# EAGLE design dado_dig (EAGLE 9.3.0)
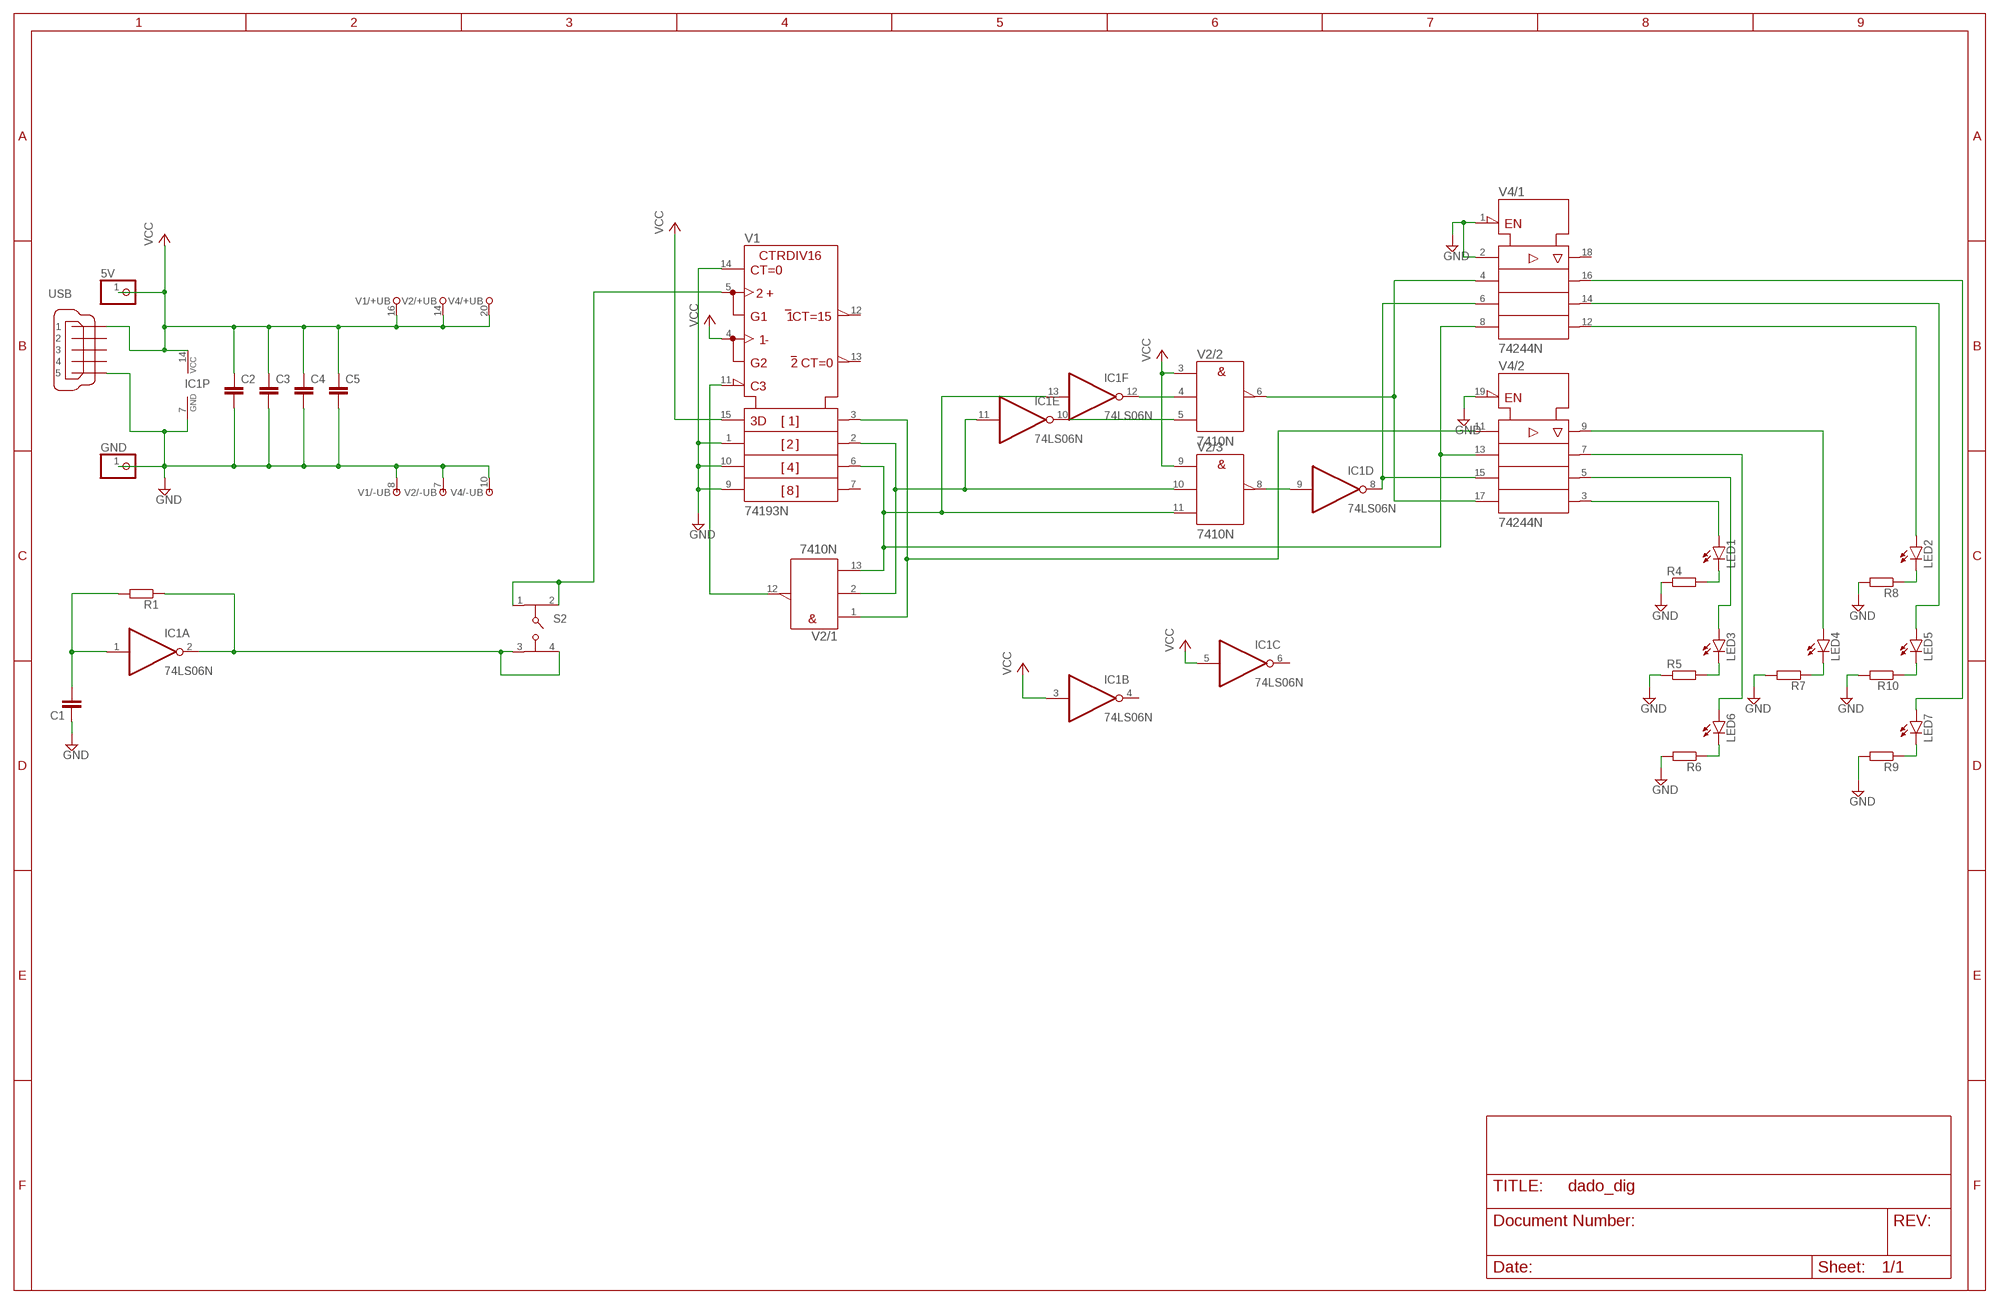
[diagram p0: schematic, sheet 1]

## Parts
5V  PINHD-1X1  [1X01]
C1  C-EUC0805K  [C0805K]
C2  C-EUC0805K  [C0805K]
C3  C-EUC0805K  [C0805K]
C4  C-EUC0805K  [C0805K]
C5  C-EUC0805K  [C0805K]
GND  PINHD-1X1  [1X01]
IC1  74LS06N  [DIL14]
LED1  LED5MM  [LED5MM]
LED2  LED5MM  [LED5MM]
LED3  LED5MM  [LED5MM]
LED4  LED5MM  [LED5MM]
LED5  LED5MM  [LED5MM]
LED6  LED5MM  [LED5MM]
LED7  LED5MM  [LED5MM]
R1  R-EU_M0805  [M0805]
R4  R-EU_M0805  [M0805]
R5  R-EU_M0805  [M0805]
R6  R-EU_M0805  [M0805]
R7  R-EU_M0805  [M0805]
R8  R-EU_M0805  [M0805]
R9  R-EU_M0805  [M0805]
R10  R-EU_M0805  [M0805]
S2  430456073736  [430456073736]
USB  MINI-USB-32005-301  [32005-301]
V1  74193N  [DIL16]
V2  7410N  [DIL14]
V4  74244N  [DIL20]

## Nets
GND: C1.1 C2.2 C3.2 C4.2 C5.2 GND.1 IC1.7(P:GND) R4.1 R5.1 R6.2 R7.2 R8.2 R9.2 R10.2 USB.5 V1.1(B) V1.8(-UB) V1.9(D) V1.10(C) V1.14(CLR) V2.7(/-UB:-UB) V4.1(/1:!G) V4.2(/1:A1) V4.10(/-UB:-UB) V4.19(/2:!G)
N$1: IC1.13(F:I) V1.6(QC) V2.11(/3:C) V2.13(/1:C) V4.8(/1:A4) V4.13(/2:A2)
N$2: IC1.9(D:I) V2.8(/3:Y)
N$3: C1.2 IC1.1(A:I) R1.2
N$4: IC1.12(F:O) V2.4(/2:B)
N$5: IC1.2(A:O) R1.1 S2.3 S2.4
N$6: V1.3(QA) V2.1(/1:A) V4.11(/2:A1)
N$7: IC1.10(E:O) V2.5(/2:C)
N$8: S2.1 S2.2 V1.5(UP)
N$10: IC1.11(E:I) V1.2(QB) V2.2(/1:B) V2.10(/3:B)
N$11: LED6.K(C) R6.1
N$12: LED4.A V4.9(/2:Y1)
N$13: LED5.K(C) R10.1
N$14: LED3.K(C) R5.2
N$15: LED5.A V4.14(/1:Y3)
N$16: LED1.A V4.3(/2:Y4)
N$17: LED4.K(C) R7.1
N$18: LED2.A V4.12(/1:Y4)
N$19: LED2.K(C) R8.1
N$20: LED7.K(C) R9.1
N$21: LED1.K(C) R4.2
N$22: LED7.A V4.16(/1:Y2)
N$24: V1.11(!LOAD) V2.12(/1:Y)
N$25: LED6.A V4.7(/2:Y2)
N$26: V2.6(/2:Y) V4.4(/1:A2) V4.17(/2:A4)
N$27: LED3.A V4.5(/2:Y3)
N$30: IC1.8(D:O) V4.6(/1:A3) V4.15(/2:A3)
VCC: 5V.1 C2.1 C3.1 C4.1 C5.1 IC1.3(B:I) IC1.5(C:I) IC1.14(P:VCC) USB.1 V1.4(DOWN) V1.15(A) V1.16(+UB) V2.3(/2:A) V2.9(/3:A) V2.14(/+UB:+UB) V4.20(/+UB:+UB)
Unconnected: IC1.4(B:O) IC1.6(C:O) USB.2 USB.3 USB.4 V1.7(QD) V1.12(!CO) V1.13(!BO) V4.18(/1:Y1)

## Library data of the parts
5V GND = pinhead:PINHD-1X1: PIN HEADER
C1-C5 = rcl:C-EU: CAPACITOR, European symbol; SPICEPREFIX: C
IC1 = 74xx-eu:74*06: Hex INVERTER, open collector high-voltage output
LED1-LED7 = led:LED: LED OSRAM: - CHIPLED LG R971, LG N971, LY N971, LG Q971, LY Q971, LO R971, LY R971 LH N974, LH R974 LS Q976, LO Q976, LY Q976 LO Q996 - Hyper CHIPLED LW Q18S LB Q993, LB Q99A, LB R99A - SideLED LS A670, LO A670, LY A670, LG A670, LP A670 LB A673, LV A673, LT A673, LW A673 LH A674 LY A675 LS A676, LA A676, LO A676, LY A676, LW A676 LS A679, LY A679, LG A679 - Hyper Micro SIDELED® LS Y876, LA Y876, LO Y876, LY Y876 LT Y87S - SmartLED LW L88C, LW L88S LB L89C, LB L89S, LG L890 LS L89K, LO L89K, LY L89K LS L896, LA L896, LO L896, LY L896 - TOPLED LS T670, LO T670, LY T670, LG T670, LP T670 LSG T670, LSP T670, LSY T670, LOP T670, LYG T670 LG T671, LOG T671, LSG T671 LB T673, LV T673, LT T673, LW T673 LH T674 LS T676, LA T676, LO T676, LY T676, LB T676, LH T676, LSB T676, LW T676 LB T67C, LV T67C, LT T67C, LS T67K, LO T67K, LY T67K, LW E67C LS E67B, LA E67B, LO E67B, LY E67B, LB E67C, LV E67C, LT E67C LW T67C LS T679, LY T679, LG T679 LS T770, LO T770, LY T770, LG T770, LP T770 LB T773, LV T773, LT T773, LW T773 LH T774 LS E675, LA E675, LY E675, LS T675 LS T776, LA T776, LO T776, LY T776, LB T776 LHGB T686 LT T68C, LB T68C - Hyper Mini TOPLED® LB M676 - Mini TOPLED Santana® LG M470 LS M47K, LO M47K, LY M47K Source: http://www.osram.convergy.de LUXEON: - LUMILED® LXK2-PW12-R00, LXK2-PW12-S00, LXK2-PW14-U00, LXK2-PW14-V00 LXK2-PM12-R00, LXK2-PM12-S00, LXK2-PM14-U00 LXK2-PE12-Q00, LXK2-PE12-R00, LXK2-PE12-S00, LXK2-PE14-T00, LXK2-PE14-U00 LXK2-PB12-K00, LXK2-PB12-L00, LXK2-PB12-M00, LXK2-PB14-N00, LXK2-PB14-P00, LXK2-PB14-Q00 LXK2-PR12-L00, LXK2-PR12-M00, LXK2-PR14-Q00, LXK2-PR14-R00 LXK2-PD12-Q00, LXK2-PD12-R00, LXK2-PD12-S00 LXK2-PH12-R00, LXK2-PH12-S00 LXK2-PL12-P00, LXK2-PL12-Q00, LXK2-PL12-R00 Source: www.luxeon.com KINGBRIGHT: KA-3528ASYC Source: www.kingbright.com
R1 R4-R10 = resistor:R-EU_: RESISTOR, European symbol
S2 = tactil:430456073736: 12x12 mm THT washable WS-TATV <http://katalog.we-online.de/media/images/v2/Family_WS_TSW_THT_4304x60xx7x6_pf2.jpg> Details see: http://katalog.we-online.de/em/datasheet/4304x60737x6.pdf 2015 (C) Wurth Elektronik; AVAILABILITY: Unavailable; DESCRIPTION: SWITCH TACTILE SPST-NO 0.05A 12V; MF: Wurth Electronics; MP: 430456073736; PACKAGE: None; PRICE: None
USB = con-cypressindustries:MINI-USB-: MINI USB-B Conector Source: www.cypressindustries.com; OC_FARNELL: unknown; OC_NEWARK: unknown
V1 = 74ttl-din:74*193: Synchronus 4-bit up down COUNTER
V2 = 74ttl-din:74*10: Triple 3-input NAND gate
V4 = 74ttl-din:74*244: Octal BUFFER and LINE DRIVER, 3-state

## Board
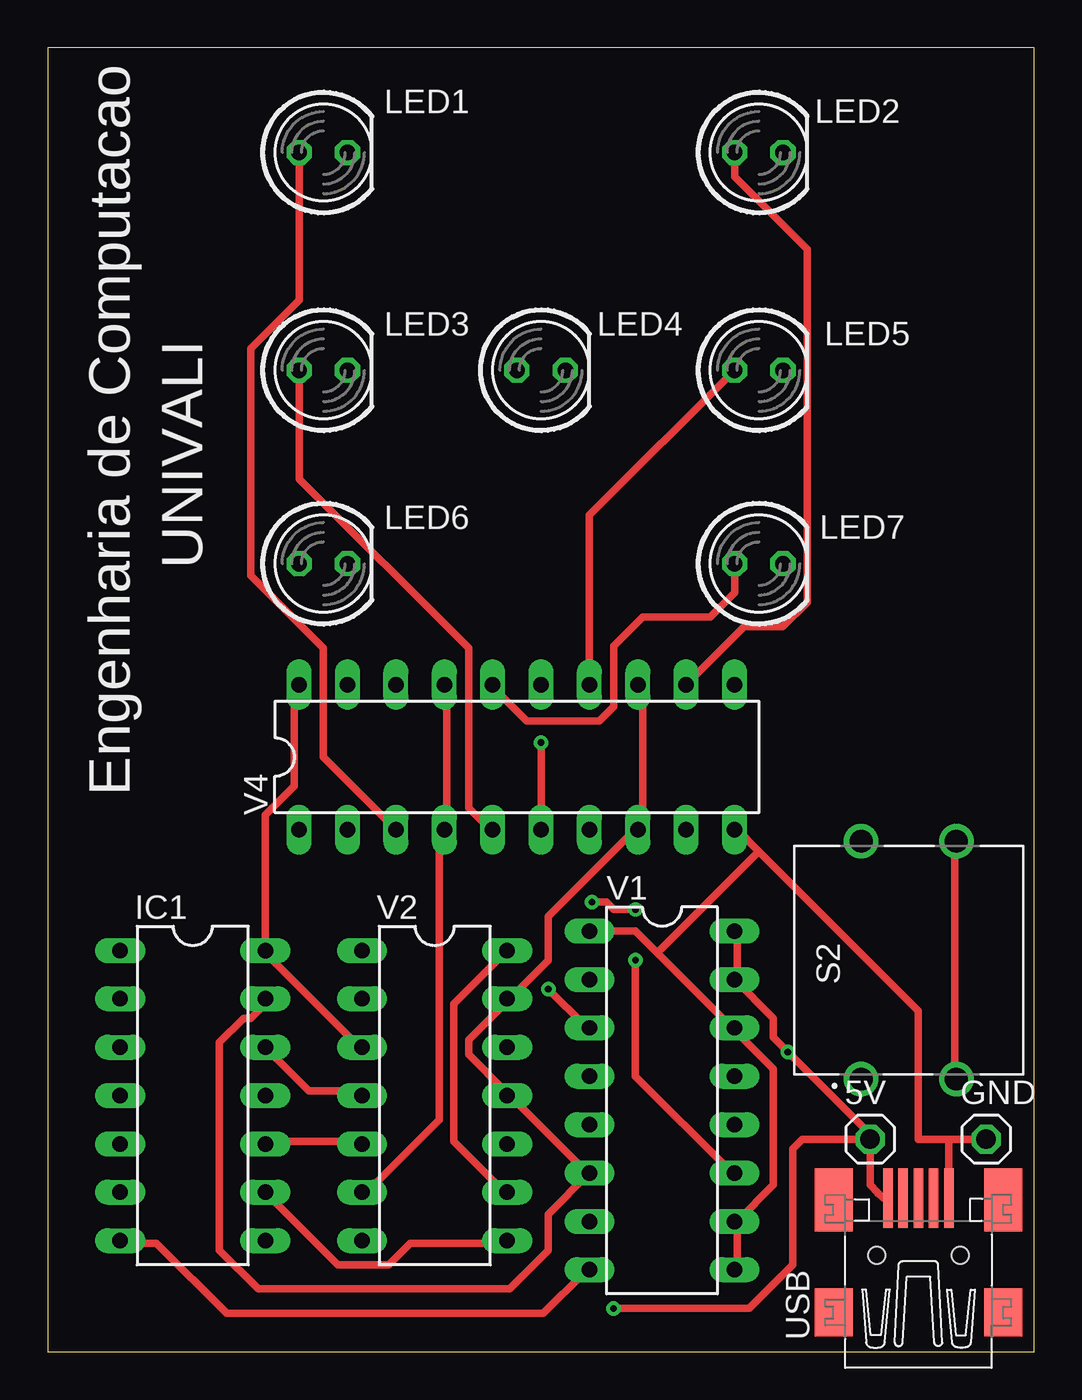
[diagram p1: board, top side]
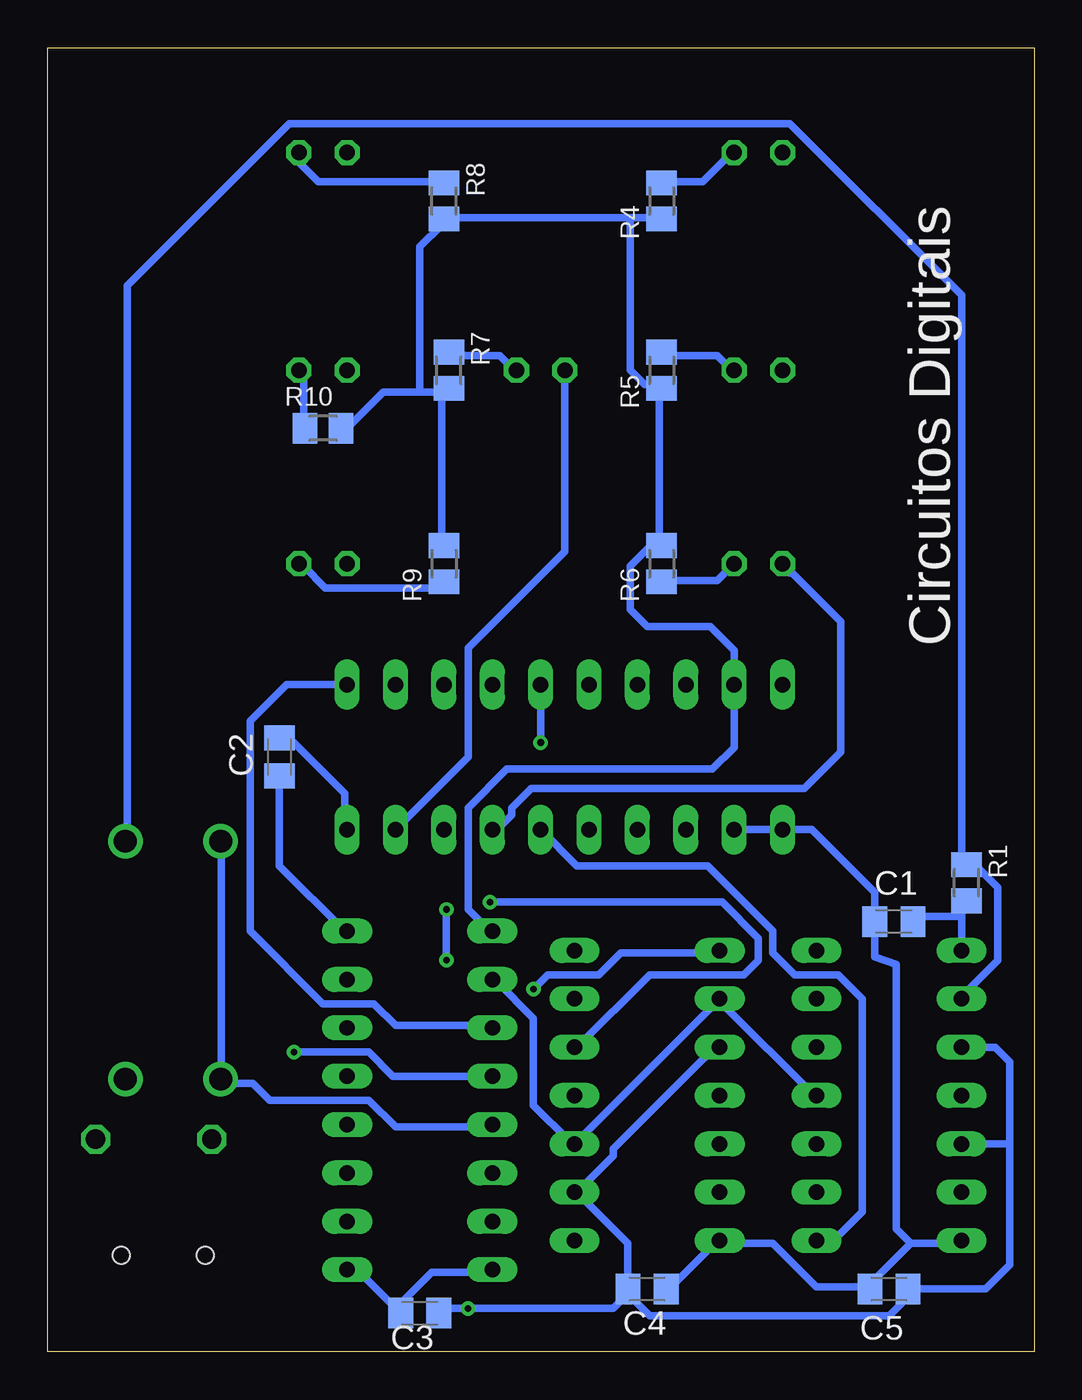
[diagram p2: board, bottom side, seen from below]

Size 51.8 x 68.5 mm. Coordinates in mm from the lower left corner, seen from the top.
Outline: 0,0 51.8,0 51.8,68.5 0,68.5 0,0
Copper layers (1*16): Top 0.035mm / dielectric 1.5mm / Bottom 0.035mm
Design rules "default *": minimum track width 15mil, minimum drill 0.35mm, track to track 15mil, track to pad 15mil, pad to pad 15mil, via to via 15mil, smd to smd 6mil, copper to edge 40mil, drill to drill 12mil, minimum pad ring 10mil, minimum via ring 8mil, stop-mask expansion 4mil, vias tented up to drill 0mil, thermal gap 10mil

### Footprints (pad centres in the part's own frame; a part is rotated, then mirrored left to right if it is on the bottom)
1X01 = drill 1.016 octagon: 1 0,0
C0805K = smd 1.3 x 1.6: 1 -1,0; 2 1,0
DIL14 = drill 0.813 long: 1 -7.62,-3.81; 2 -5.08,-3.81; 3 -2.54,-3.81; 4 0,-3.81; 5 2.54,-3.81; 6 5.08,-3.81; 7 7.62,-3.81; 8 7.62,3.81; 9 5.08,3.81; 10 2.54,3.81; 11 0,3.81; 12 -2.54,3.81; 13 -5.08,3.81; 14 -7.62,3.81
LED5MM = drill 0.813 octagon: A -1.27,0; K 1.27,0
M0805 = smd 1.3 x 1.6: 1 -0.95,0; 2 0.95,0
430456073736 = drill 1.2: 1 -6.25,2.5; 2 6.25,2.5; 3 -6.25,-2.5; 4 6.25,-2.5
32005-301 = smd 3.1 x 0.5: 1 3,1.6; 2 3,0.8; 3 3,0; 4 3,-0.8; 5 3,-1.6 | smd 2.5 x 2: M1 -3,-4.45; M2 -3,4.45 | smd 3.3 x 2: M3 2.9,4.45; M4 2.9,-4.45 | hole 0.9: 0,2.2; 0,-2.2
DIL16 = drill 0.813 long: 1 -8.89,-3.81; 2 -6.35,-3.81; 3 -3.81,-3.81; 4 -1.27,-3.81; 5 1.27,-3.81; 6 3.81,-3.81; 7 6.35,-3.81; 8 8.89,-3.81; 9 8.89,3.81; 10 6.35,3.81; 11 3.81,3.81; 12 1.27,3.81; 13 -1.27,3.81; 14 -3.81,3.81; 15 -6.35,3.81; 16 -8.89,3.81
DIL20 = drill 0.813 long: 1 -11.43,-3.81; 2 -8.89,-3.81; 3 -6.35,-3.81; 4 -3.81,-3.81; 5 -1.27,-3.81; 6 1.27,-3.81; 7 3.81,-3.81; 8 6.35,-3.81; 9 8.89,-3.81; 10 11.43,-3.81; 11 11.43,3.81; 12 8.89,3.81; 13 6.35,3.81; 14 3.81,3.81; 15 1.27,3.81; 16 -1.27,3.81; 17 -3.81,3.81; 18 -6.35,3.81; 19 -8.89,3.81; 20 -11.43,3.81

### Placement (x,y rotation side)
5V  43.18,11.18 0 top
C1  7.37,22.61 0 bottom
C2  39.62,31.24 90 bottom
C3  32.26,2.03 180 bottom
C4  20.32,3.3 0 bottom
C5  7.62,3.3 180 bottom
GND  49.28,11.18 0 top
IC1  7.62,13.46 270 top
LED1  14.48,62.99 0 top
LED2  37.34,62.99 0 top
LED3  14.48,51.56 0 top
LED4  25.91,51.56 0 top
LED5  37.34,51.56 0 top
LED6  14.48,41.4 0 top
LED7  37.34,41.4 0 top
R1  3.56,24.64 270 bottom
R4  19.56,60.45 90 bottom
R5  19.56,51.56 90 bottom
R6  19.56,41.4 90 bottom
R7  30.73,51.56 270 bottom
R8  30.99,60.45 270 bottom
R9  30.99,41.4 90 bottom
R10  37.34,48.51 0 bottom
S2  45.21,20.57 90 top
USB  45.72,5.08 90 top
V1  32.26,13.21 270 top
V2  20.32,13.46 270 top
V4  24.64,31.24 0 top

### Tracks (layer width: path | path; a pad name or v marks a point on that pad's centre or on a via)
GND
  Top 0.381: 36.2,6.86 36.2,4.57 V1.9 | 32,20.95 30.86,22.1 V1.1 | 32,20.95 35.81,17.14 V1.14 36.2,16.76 38.1,14.86 38.1,8.76 36.2,6.86 | 36.2,6.86 V1.10 | 37.34,26.29 36.2,27.43 V4.10 | 37.34,26.29 45.72,17.91 45.72,11.18 47.24,11.18 | 37.34,26.29 32,20.95 | IC1.7 3.81,5.71 5.71,5.71 9.4,2.03 26.04,2.03 28.19,4.19 V1.8 | GND.1 47.24,11.18 | USB.5 47.32,11.1 47.24,11.18
  Bottom 0.381: 32.26,50.42 34.16,50.42 36.07,48.51 R10.2 | 32.26,50.42 31.11,50.42 | 31.11,50.42 30.73,50.42 R7.2 31.11,50.42 | 31.11,50.42 31.11,42.42 R9.2 | V4.19 15.88,34.92 | 19.68,42.8 19.68,50.42 R5.1 19.68,50.8 20.45,50.8 21.21,51.56 21.21,59.56 | 19.68,42.8 19.68,42.42 R6.2 19.68,42.8 | 21.21,59.56 30.73,59.56 R8.2 31.11,59.18 32.26,58.04 32.26,50.42 | 21.21,59.56 19.68,59.56 R4.1 | 19.68,42.8 21.21,41.27 21.21,38.99 20.32,38.1 17.02,38.1 15.75,36.83 V4.19 | C4.2 19.05,3.43 16.76,5.71 V2.7 16.38,5.71 13.72,5.71 11.43,3.43 8.76,3.43 C5.2 8.38,3.43 8.38,3.81 6.48,5.71 | 6.48,5.71 3.81,5.71 IC1.7 | 6.48,5.71 7.24,6.48 7.24,20.35 8.37,20.74 C1.1 8.38,22.62 8.38,24.13 11.68,27.43 V4.1 V4.2 | 33.53,2.29 35.81,4.57 V1.9 | 33.53,2.29 31.62,4.19 28.57,4.19 V1.8 | 33.53,2.29 C3.2 | C2.2 39.62,32 38.86,32 36.2,29.34 36.2,27.43 V4.10 | V1.1 28.57,22.1 29.72,23.24 29.72,28.57 27.69,30.61 16.89,30.61 15.75,31.75 V4.19
N$1
  Top 0.381: V4.13 31.24,35.05 31.24,27.43 V4.8 30.86,27.43 26.29,22.86 26.29,20.57 24.38,18.67 V2.13 24,18.29 22.1,16.38 22.1,15.62 24,13.72 V2.11 24.38,13.34 28.19,9.53 V1.6 26.29,7.24 26.29,5.33 24.26,3.3 11.05,3.3 9.02,5.33 9.02,16.26 10.29,17.53 10.67,17.53 11.43,18.29 IC1.13
N$2
  Top 0.381: IC1.9 15.24,4.57 17.91,4.57 19.05,5.71 24,5.71 V2.8
N$3
  Bottom 0.381: IC1.1 3.81,22.86 | 3.81,22.86 3.81,23.62 R1.2 | 3.81,22.86 6.1,22.86 C1.2
N$4
  Top 0.381: IC1.12 13.72,13.72 16.38,13.72 V2.4
N$5
  Top 0.381: S2.3 47.62,14.48 47.62,26.67 S2.4
  Bottom 0.381: IC1.2 3.81,18.67 1.91,20.57 1.91,24.38 3.05,25.53 3.43,25.53 R1.1 3.81,25.91 3.81,55.5 12.83,64.52 39.12,64.52 47.62,56.01 47.62,27.05 S2.4
N$6  (via drill 0.35)
  Top 0.381: v26.29,19.05 28.19,17.14 V1.3
  Bottom 0.381: V4.11 39.24,35.05 41.15,33.15 41.15,22.1 37.34,18.29 34.67,18.29 33.53,17.14 28.57,17.14 V1.3 | v26.29,19.05 25.53,19.81 22.86,19.81 21.72,20.95 16.76,20.95 V2.1
N$7
  Top 0.381: IC1.10 11.43,11.05 16.38,11.05 V2.5
N$8
  Bottom 0.381: V1.5 28.57,11.81 33.53,11.81 34.92,13.21 40.13,13.21 41.02,14.1 42.67,14.1 S2.1 42.67,14.48 42.67,26.67 S2.2
N$10
  Bottom 0.381: IC1.11 11.56,13.46 16.38,18.29 V2.2 V2.10 24.38,11.05 26.29,12.95 26.29,17.53 28.19,19.43 V1.2
N$11
  Bottom 0.381: LED6.K 16.64,40.51 19.3,40.51 R6.1
N$12
  Bottom 0.381: LED4.A 24.64,42.04 29.72,36.96 29.72,31.24 V4.9
N$13
  Bottom 0.381: R10.1 38.35,48.51 38.35,51.56 LED5.K
N$14
  Bottom 0.381: R5.2 19.3,52.32 16.64,52.32 15.88,51.56 LED3.K
N$15
  Top 0.381: V4.14 28.45,43.94 LED5.A
N$16
  Top 0.381: LED1.A 13.21,55.24 10.67,52.7 10.67,40.77 14.48,36.96 14.48,31.24 V4.3
N$17
  Bottom 0.381: R7.1 30.73,52.32 28.07,52.32 27.3,51.56 LED4.K
N$18
  Top 0.381: LED2.A 36.07,61.72 39.88,57.91 39.88,39.37 38.61,38.1 36.58,38.1 V4.12
N$19
  Bottom 0.381: LED2.K 38.61,62.48 37.59,61.47 31.11,61.47 R8.1
N$20
  Bottom 0.381: R9.1 31.11,40.13 37.21,40.13 38.35,41.27 LED7.K
N$21
  Bottom 0.381: R4.2 19.3,61.47 17.4,61.47 15.88,62.99 LED1.K
N$22
  Top 0.381: V4.16 23.62,35.05 23.62,34.67 25.15,33.15 28.96,33.15 29.72,33.91 29.72,37.08 31.24,38.61 34.8,38.61 36.07,39.88 LED7.A
N$24  (via drill 0.35)
  Top 0.381: v30.86,20.57 30.86,14.48 35.81,9.53 V1.11 | v30.86,23.24 29.72,23.24 29.34,23.62 v28.57,23.62
  Bottom 0.381: v30.86,23.24 v30.86,20.57 | v28.57,23.62 16.38,23.62 14.48,21.72 14.48,20.57 15.24,19.81 20.19,19.81 24,16 V2.12
N$25
  Bottom 0.381: 12.83,40.89 13.21,41.27 LED6.A 10.16,38.35 10.16,31.5 12.06,29.59 26.42,29.59 27.43,28.57 27.43,28.19 28.19,27.43 V4.7
N$26
  Top 0.381: V2.6 16.76,8.38 20.57,12.19 20.57,27.43 V4.4 20.95,27.43 20.95,35.05 V4.17
N$27
  Top 0.381: LED3.A 13.21,45.85 22.1,36.96 22.1,28.57 23.24,27.43 V4.5
N$30  (via drill 0.35)
  Top 0.381: V4.6 v25.91,32
  Bottom 0.381: IC1.8 10.41,5.84 10.48,5.91 9.02,7.37 9.02,18.54 10.29,19.81 12.57,19.81 13.72,20.95 13.72,22.1 17.14,25.53 24,25.53 V4.6 | v25.91,32 V4.15
VCC  (via drill 0.35)
  Top 0.381: V1.16 36.2,22.1 36.2,19.81 V1.15 38.1,17.53 38.1,16.51 v38.86,15.75 43.05,11.56 43.05,11.18 5V.1 | V2.3 16.38,16 11.43,20.95 IC1.14 11.43,28.19 12.95,29.72 12.95,35.05 V4.20 | V2.14 21.34,18.29 21.34,11.05 24,8.38 V2.9 | v29.72,2.29 36.83,2.29 39.12,4.57 39.12,10.67 39.62,11.18 5V.1 | 5V.1 43.18,8.77 43.59,8.36 | 43.59,8.36 43.59,8.33 | USB.1 43.87,8.08 43.59,8.36
  Bottom 0.381: C2.1 39.62,25.53 36.2,22.1 V1.16 | 21.34,3.05 20.19,1.91 7.62,1.91 6.86,2.67 6.86,3.05 C5.1 2.54,3.3 1.27,4.57 1.27,10.92 | 21.34,3.05 22.1,2.29 v29.72,2.29 31.24,2.29 C3.1 | 21.34,3.05 C4.1 21.34,3.43 21.34,5.71 24,8.38 | 24,8.38 22.1,10.29 22.1,10.67 16.76,16 V2.3 | 24,8.38 V2.9 | 1.27,10.92 1.27,15.24 2.03,16 IC1.3 | IC1.5 1.27,10.92 | V1.4 33.66,14.48 34.94,15.75 v38.86,15.75

### Text on the board
tNames: UNIVALI | Engenharia de Computacao
bNames: Circuitos Digitais